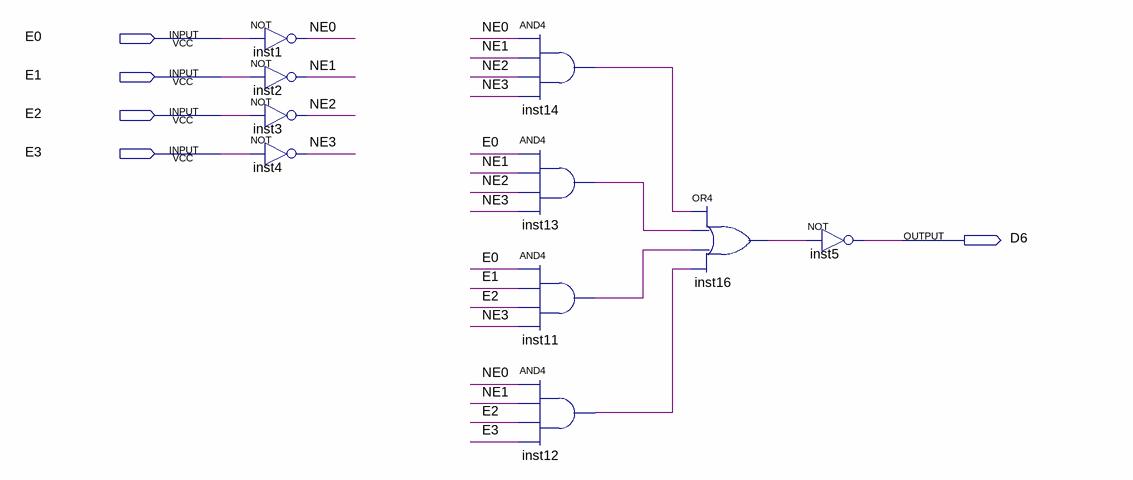
[diagram p0: schematic sheet]
// Quartus schematic D6.bdf as structural Verilog: 10 symbols, 5 pins
module D6 (
  input  E0,
  input  E1,
  input  E2,
  input  E3,
  output D6
);

  wire inst11_out, inst12_out, inst13_out, inst14_out, inst16_out, NE0, NE1, NE2, NE3;

  not inst1 (NE0, E0);
  not inst2 (NE1, E1);
  not inst3 (NE2, E2);
  not inst4 (NE3, E3);
  and inst14 (inst14_out, NE0, NE1, NE2, NE3);
  and inst13 (inst13_out, E0, NE1, NE2, NE3);
  and inst11 (inst11_out, E0, E1, E2, NE3);
  and inst12 (inst12_out, NE0, NE1, E2, E3);
  or inst16 (inst16_out, inst14_out, inst13_out, inst11_out, inst12_out);
  not inst5 (D6, inst16_out);
endmodule
